# EAGLE board cw-lite-main (EAGLE 9.5.0), part 1 of 2
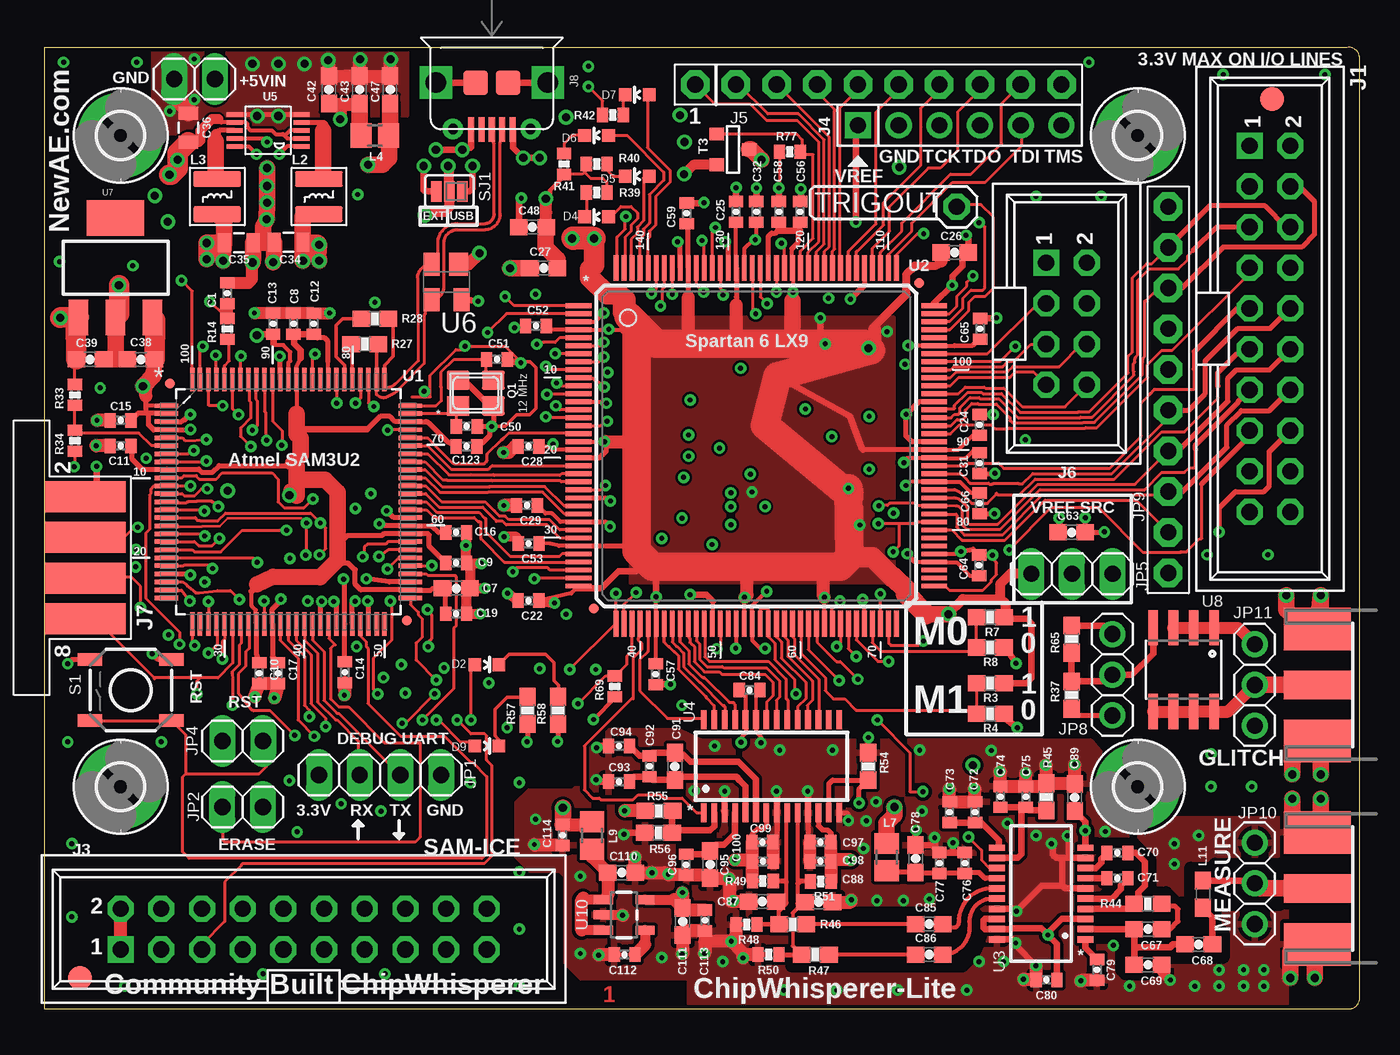
[diagram p8: board, top side]
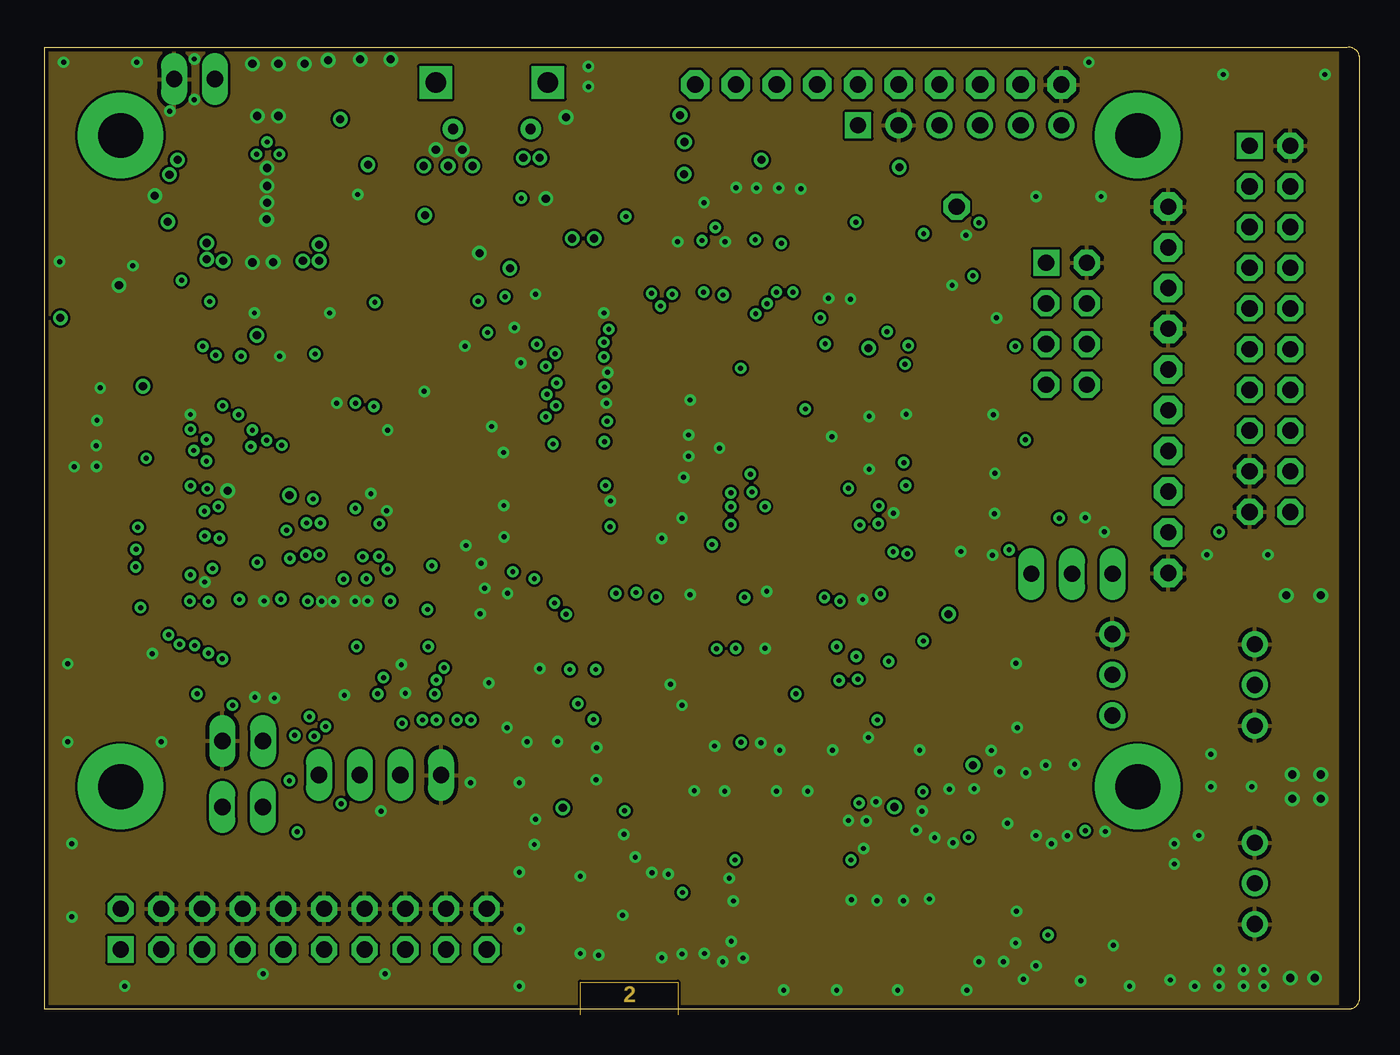
[diagram p9: board, inner layer GNDPour]
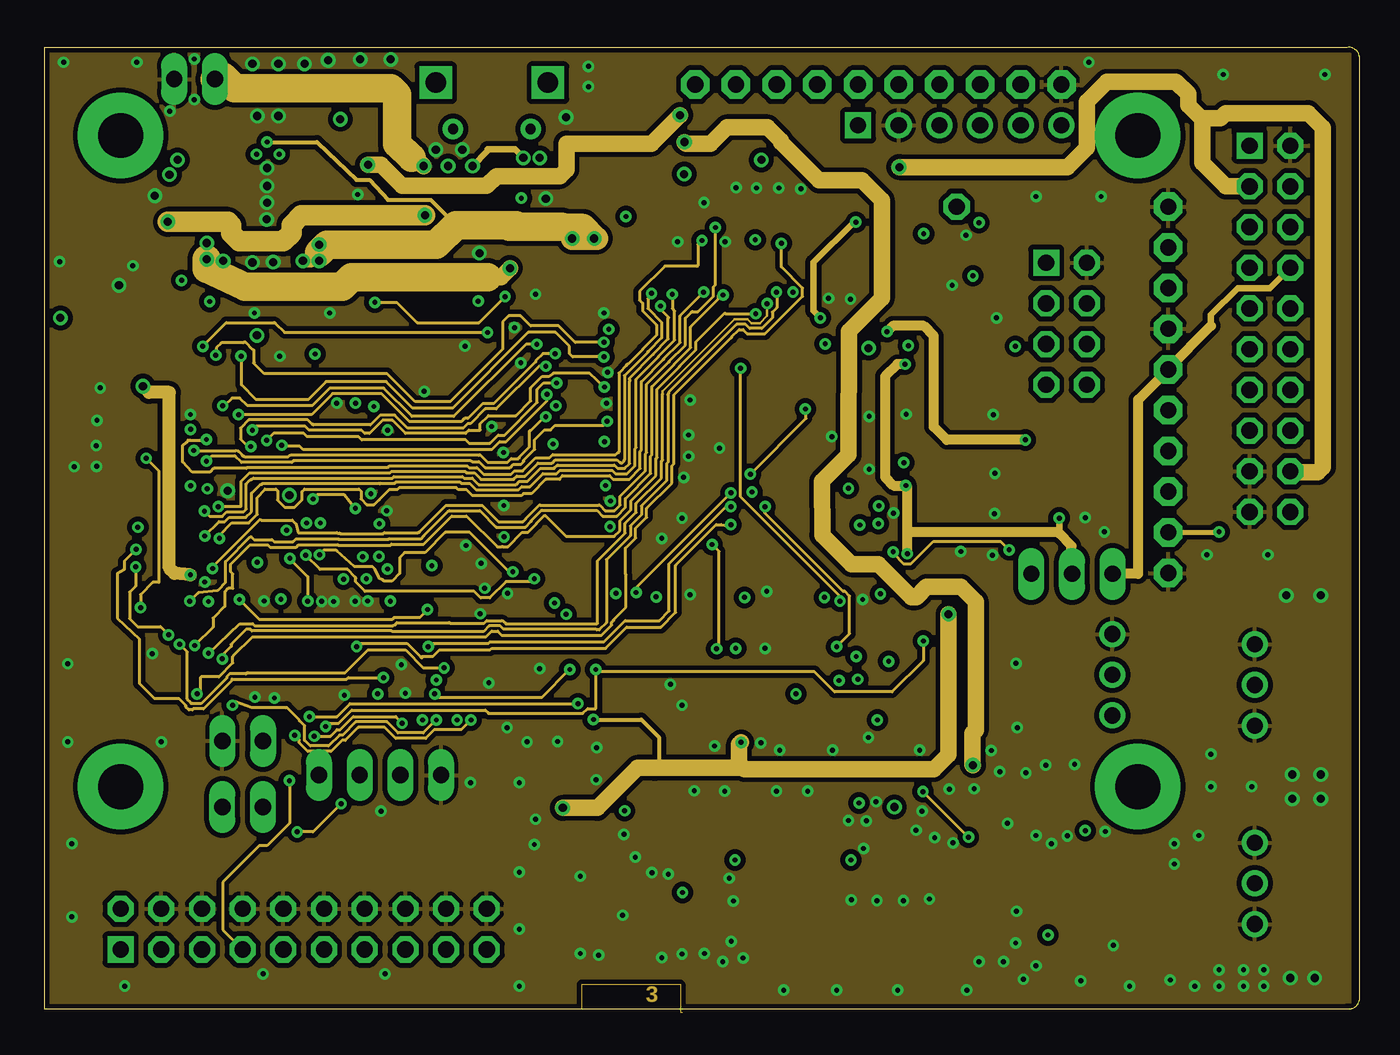
[diagram p10: board, inner layer Route15]
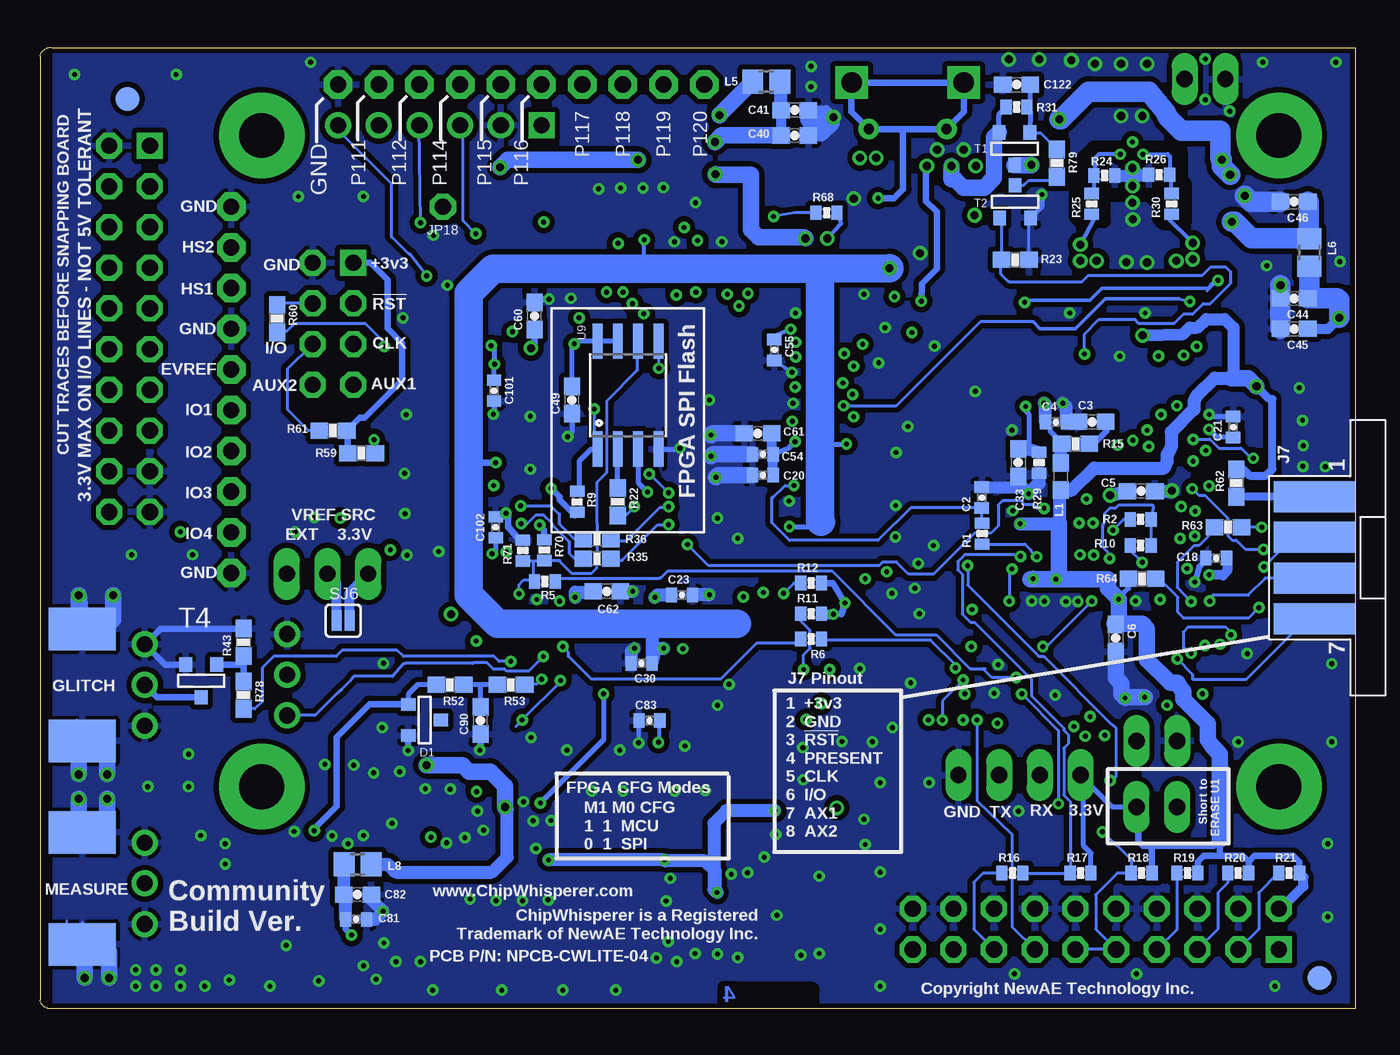
[diagram p11: board, bottom side, seen from below]

Size 82.12 x 60 mm. Coordinates in mm from the lower left corner, seen from the top.
Outline: 0,0 81.36,0.02 arc90 82.12,0.53 82.12,59.45 arc90 81.36,59.99 0,59.99 0,0
Copper layers (1*2*15*16): Top 0.035mm / dielectric 0.3mm / GNDPour 0.035mm / dielectric 0.86mm / Route15 0.035mm / dielectric 0.3mm / Bottom 0.035mm
Design rules "default *": minimum track width 6mil, minimum drill 12mil, track to track 6mil, track to pad 6mil, pad to pad 6mil, via to via 6mil, smd to smd 0mil, copper to edge 10mil, drill to drill 10mil, minimum pad ring 12mil, minimum via ring 8mil, stop-mask expansion 2mil, vias tented up to drill 25mil, thermal gap 10mil
Net classes: 0 default: width 0.152 mm; 1 USB Differential: width 0.191 mm, clearance 0.191 mm; 2 power: width 0.254 mm
tRestrict: 28 lines
bRestrict: 22 lines

## Footprints (pad centres in the part's own frame; a part is rotated, then mirrored left to right if it is on the bottom)
0402C = smd 0.7 x 0.9: 1 -0.65,0; 2 0.65,0
0603C = smd 1.1 x 1: 1 -0.85,0; 2 0.85,0
0805 = smd 0.8 x 1.2: 1 -0.9,0; 2 0.9,0
SOT-23 = smd 0.787 x 0.889: 1 0.025,-1.016; 2 -0.94,1.016; 3 0.991,1.016
LED-0603 = smd 0.8 x 0.8: A 0,-0.75; C 0,0.75
FIDUCIAL-1.5X3 = smd 1.5 x 1.5: 1 0,0
2,8-PAD = drill 2.8 pad 5.334: B2,8 0,0
PINSHRD_PTH_2X10 = drill 1.016 square: 1 -11.43,-1.27 | drill 1.016 octagon: 2 -11.43,1.27; 3 -8.89,-1.27; 4 -8.89,1.27; 5 -6.35,-1.27; 6 -6.35,1.27; 7 -3.81,-1.27; 8 -3.81,1.27; 9 -1.27,-1.27; 10 -1.27,1.27; 11 1.27,-1.27; 12 1.27,1.27; 13 3.81,-1.27; 14 3.81,1.27; 15 6.35,-1.27; 16 6.35,1.27; 17 8.89,-1.27; 18 8.89,1.27; 19 11.43,-1.27; 20 11.43,1.27
HEADER_PRG_1X06 = drill 1.016 square: 1 -6.35,0 | drill 1.016: 2 -3.81,0; 3 -1.27,0; 4 1.27,0; 5 3.81,0; 6 6.35,0
1X10-BIG = drill 1.016 pad 1.778 octagon: 1 -11.43,0; 2 -8.89,0; 3 -6.35,0; 4 -3.81,0; 5 -1.27,0; 6 1.27,0; 7 3.81,0; 8 6.35,0; 9 8.89,0; 10 11.43,0
PINSHRD_PTH_2X04 = drill 1.016 square: 1 -3.81,-1.27 | drill 1.016 octagon: 2 -3.81,1.27; 3 -1.27,-1.27; 4 -1.27,1.27; 5 1.27,-1.27; 6 1.27,1.27; 7 3.81,-1.27; 8 3.81,1.27
PINSHRD_EDGE_2X04.PAC = smd 1.93 x 5.08 bottom: 1 -3.81,0; 3 -1.27,0; 5 1.27,0; 7 3.81,0 | smd 1.93 x 5.08: 2 -3.81,0; 4 -1.27,0; 6 1.27,0; 8 3.81,0
B-SMD-5P-TH = smd 0.38 x 1.52: 1 -1.3,2.921; 2 -0.65,2.921; 3 0,2.921; 4 0.65,2.921; 5 1.3,2.921 | smd 1.524 x 1.524: E1 -1.016,0; E2 1.016,0 | drill 1.27 pad 2.032 square: P$1 -3.5,0; P$2 3.5,0 | drill 0.635 pad 1.27: P$3 -2.425,2.9; P$4 2.425,2.9
1X04 = drill 1.016 long: 1 -3.81,0; 2 -1.27,0; 3 1.27,0; 4 3.81,0
1X02 = drill 1.016 long: 1 -1.27,0; 2 1.27,0
1X03 = drill 1.016 long: 1 -2.54,0; 2 0,0; 3 2.54,0
1X03' = drill 1.016: 1 -2.54,0; 2 0,0; 3 2.54,0
1X01 = drill 1.016 octagon: 1 0,0
0603 = smd 1.1 x 1: 1 -0.85,0; 2 0.85,0
VLS3015 = smd 3 x 1: 1 0,1.1; 2 0,-1.1
FB603 = smd 1.3 x 1.5: 1 -0.85,0; 2 0.85,0
MICRO-FIDUCIAL = smd 0.635 x 0.635: 1 0,0
NX3225 = smd 1.4 x 1.2: 1 -1.1,-0.8; 2 1.1,-0.8; 3 1.1,0.8; 4 -1.1,0.8
0402R = smd 0.7 x 0.9: 1 -0.65,0; 2 0.65,0
0603R = smd 1.1 x 1: 1 -0.85,0; 2 0.85,0
TACTILE_SWITCH_SMD = smd 1.524 x 0.762: 1 -2.54,1.905; 2 2.54,1.905; 3 -2.54,-1.905; 4 2.54,-1.905
SJ_3_PASTE1&2 = smd 0.635 x 1.27: 1 -0.813,0; 2 0,0; 3 0.813,0
SJ_2S = smd 0.635 x 1.27: 1 -0.412,0; 2 0.412,0
QFP50P1600X1600X160-100N = smd 1.473 x 0.279: 1 -7.62,5.994; 2 -7.62,5.512; 3 -7.62,5.004; 4 -7.62,4.496; 5 -7.62,3.988; 6 -7.62,3.505; 7 -7.62,2.997; 8 -7.62,2.489; 9 -7.62,2.007; 10 -7.62,1.499; 11 -7.62,0.991; 12 -7.62,0.508; 13 -7.62,0; 14 -7.62,-0.508; 15 -7.62,-0.991; 16 -7.62,-1.499; 17 -7.62,-2.007; 18 -7.62,-2.489; 19 -7.62,-2.997; 20 -7.62,-3.505; 21 -7.62,-3.988; 22 -7.62,-4.496; 23 -7.62,-5.004; 24 -7.62,-5.512; 25 -7.62,-5.994; 51 7.62,-5.994; 52 7.62,-5.512; 53 7.62,-5.004; 54 7.62,-4.496; 55 7.62,-3.988; 56 7.62,-3.505; 57 7.62,-2.997; 58 7.62,-2.489; 59 7.62,-2.007; 60 7.62,-1.499; 61 7.62,-0.991; 62 7.62,-0.508; 63 7.62,0; 64 7.62,0.508; 65 7.62,0.991; 66 7.62,1.499; 67 7.62,2.007; 68 7.62,2.489; 69 7.62,2.997; 70 7.62,3.505; 71 7.62,3.988; 72 7.62,4.496; 73 7.62,5.004; 74 7.62,5.512; 75 7.62,5.994 | smd 0.279 x 1.473: 26 -5.994,-7.62; 27 -5.512,-7.62; 28 -5.004,-7.62; 29 -4.496,-7.62; 30 -3.988,-7.62; 31 -3.505,-7.62; 32 -2.997,-7.62; 33 -2.489,-7.62; 34 -2.007,-7.62; 35 -1.499,-7.62; 36 -0.991,-7.62; 37 -0.508,-7.62; 38 0,-7.62; 39 0.508,-7.62; 40 0.991,-7.62; 41 1.499,-7.62; 42 2.007,-7.62; 43 2.489,-7.62; 44 2.997,-7.62; 45 3.505,-7.62; 46 3.988,-7.62; 47 4.496,-7.62; 48 5.004,-7.62; 49 5.512,-7.62; 50 5.994,-7.62; 76 5.994,7.62; 77 5.512,7.62; 78 5.004,7.62; 79 4.496,7.62; 80 3.988,7.62; 81 3.505,7.62; 82 2.997,7.62; 83 2.489,7.62; 84 2.007,7.62; 85 1.499,7.62; 86 0.991,7.62; 87 0.508,7.62; 88 0,7.62; 89 -0.508,7.62; 90 -0.991,7.62; 91 -1.499,7.62; 92 -2.007,7.62; 93 -2.489,7.62; 94 -2.997,7.62; 95 -3.505,7.62; 96 -3.988,7.62; 97 -4.496,7.62; 98 -5.004,7.62; 99 -5.512,7.62; 100 -5.994,7.62
TQ144 = smd 1.6 x 0.3: P1 -11.1,8.75; P2 -11.1,8.25; P3 -11.1,7.75; P4 -11.1,7.25; P5 -11.1,6.75; P6 -11.1,6.25; P7 -11.1,5.75; P8 -11.1,5.25; P9 -11.1,4.75; P10 -11.1,4.25; P11 -11.1,3.75; P12 -11.1,3.25; P13 -11.1,2.75; P14 -11.1,2.25; P15 -11.1,1.75; P16 -11.1,1.25; P17 -11.1,0.75; P18 -11.1,0.25; P19 -11.1,-0.25; P20 -11.1,-0.75; P21 -11.1,-1.25; P22 -11.1,-1.75; P23 -11.1,-2.25; P24 -11.1,-2.75; P25 -11.1,-3.25; P26 -11.1,-3.75; P27 -11.1,-4.25; P28 -11.1,-4.75; P29 -11.1,-5.25; P30 -11.1,-5.75; P31 -11.1,-6.25; P32 -11.1,-6.75; P33 -11.1,-7.25; P34 -11.1,-7.75; P35 -11.1,-8.25; P36 -11.1,-8.75; P73 11.1,-8.75; P74 11.1,-8.25; P75 11.1,-7.75; P76 11.1,-7.25; P77 11.1,-6.75; P78 11.1,-6.25; P79 11.1,-5.75; P80 11.1,-5.25; P81 11.1,-4.75; P82 11.1,-4.25; P83 11.1,-3.75; P84 11.1,-3.25; P85 11.1,-2.75; P86 11.1,-2.25; P87 11.1,-1.75; P88 11.1,-1.25; P89 11.1,-0.75; P90 11.1,-0.25; P91 11.1,0.25; P92 11.1,0.75; P93 11.1,1.25; P94 11.1,1.75; P95 11.1,2.25; P96 11.1,2.75; P97 11.1,3.25; P98 11.1,3.75; P99 11.1,4.25; P100 11.1,4.75; P101 11.1,5.25; P102 11.1,5.75; P103 11.1,6.25; P104 11.1,6.75; P105 11.1,7.25; P106 11.1,7.75; P107 11.1,8.25; P108 11.1,8.75 | smd 0.3 x 1.6: P37 -8.75,-11.1; P38 -8.25,-11.1; P39 -7.75,-11.1; P40 -7.25,-11.1; P41 -6.75,-11.1; P42 -6.25,-11.1; P43 -5.75,-11.1; P44 -5.25,-11.1; P45 -4.75,-11.1; P46 -4.25,-11.1; P47 -3.75,-11.1; P48 -3.25,-11.1; P49 -2.75,-11.1; P50 -2.25,-11.1; P51 -1.75,-11.1; P52 -1.25,-11.1; P53 -0.75,-11.1; P54 -0.25,-11.1; P55 0.25,-11.1; P56 0.75,-11.1; P57 1.25,-11.1; P58 1.75,-11.1; P59 2.25,-11.1; P60 2.75,-11.1; P61 3.25,-11.1; P62 3.75,-11.1; P63 4.25,-11.1; P64 4.75,-11.1; P65 5.25,-11.1; P66 5.75,-11.1; P67 6.25,-11.1; P68 6.75,-11.1; P69 7.25,-11.1; P70 7.75,-11.1; P71 8.25,-11.1; P72 8.75,-11.1; P109 8.75,11.1; P110 8.25,11.1; P111 7.75,11.1; P112 7.25,11.1; P113 6.75,11.1; P114 6.25,11.1; P115 5.75,11.1; P116 5.25,11.1; P117 4.75,11.1; P118 4.25,11.1; P119 3.75,11.1; P120 3.25,11.1; P121 2.75,11.1; P122 2.25,11.1; P123 1.75,11.1; P124 1.25,11.1; P125 0.75,11.1; P126 0.25,11.1; P127 -0.25,11.1; P128 -0.75,11.1; P129 -1.25,11.1; P130 -1.75,11.1; P131 -2.25,11.1; P132 -2.75,11.1; P133 -3.25,11.1; P134 -3.75,11.1; P135 -4.25,11.1; P136 -4.75,11.1; P137 -5.25,11.1; P138 -5.75,11.1; P139 -6.25,11.1; P140 -6.75,11.1; P141 -7.25,11.1; P142 -7.75,11.1; P143 -8.25,11.1; P144 -8.75,11.1
QSOP20 = smd 0.4 x 1: 1 -2.858,-2.75; 2 -2.223,-2.75; 3 -1.588,-2.75; 4 -0.953,-2.75; 5 -0.318,-2.75; 6 0.318,-2.75; 7 0.953,-2.75; 8 1.588,-2.75; 9 2.223,-2.75; 10 2.858,-2.75; 11 2.858,2.75; 12 2.223,2.75; 13 1.588,2.75; 14 0.953,2.75; 15 0.318,2.75; 16 -0.318,2.75; 17 -0.953,2.75; 18 -1.588,2.75; 19 -2.223,2.75; 20 -2.858,2.75
TSSOP28 = smd 0.35 x 1.2: 1 -4.225,-2.9; 2 -3.575,-2.9; 3 -2.925,-2.9; 4 -2.275,-2.9; 5 -1.625,-2.9; 6 -0.975,-2.9; 7 -0.325,-2.9; 8 0.325,-2.9; 9 0.975,-2.9; 10 1.625,-2.9; 11 2.275,-2.9; 12 2.925,-2.9; 13 3.575,-2.9; 14 4.225,-2.9; 15 4.225,2.9; 16 3.575,2.9; 17 2.925,2.9; 18 2.275,2.9; 19 1.625,2.9; 20 0.975,2.9; 21 0.325,2.9; 22 -0.325,2.9; 23 -0.975,2.9; 24 -1.625,2.9; 25 -2.275,2.9; 26 -2.925,2.9; 27 -3.575,2.9; 28 -4.225,2.9
MSOP10 = smd 0.28 x 1: 1 -1,-2.1; 2 -0.5,-2.1; 3 0,-2.1; 4 0.5,-2.1; 5 1,-2.1; 6 1,2.1; 7 0.5,2.1; 8 0,2.1; 9 -0.5,2.1; 10 -1,2.1
SOT143B = smd 1.2 x 1.44: 1 -0.75,-1.1 | smd 1 x 1.44: 2 0.95,-1.1; 3 0.95,1.1; 4 -0.95,1.1
SOT223 = smd 1.219 x 2.235: 1 -2.311,-3.099; 2 0,-3.099; 3 2.311,-3.099 | smd 3.6 x 2.2: 4 0,3.099
SO08 = smd 0.61 x 2.21: 1 -1.905,-2.616; 2 -0.635,-2.616; 3 0.635,-2.616; 4 1.905,-2.616; 5 1.905,2.616; 6 0.635,2.616; 7 -0.635,2.616; 8 -1.905,2.616
SO08-EIAJ = smd 0.61 x 2.21: 1 -1.905,-3.378; 2 -0.635,-3.378; 3 0.635,-3.378; 4 1.905,-3.378; 5 1.905,3.353; 6 0.635,3.353; 7 -0.635,3.353; 8 -1.905,3.353
SOT23-5 = smd 0.55 x 1.2: 1 -0.95,-1.3; 2 0,-1.3; 3 0.95,-1.3; 4 0.95,1.3; 5 -0.95,1.3
J502-ND-142-0711-821/826-NOSILK = smd 4.191 x 1.778: 1 2.115,0 | smd 4.191 x 2.667: G@1 2.115,3.495; G@2 2.115,-3.495 | smd 4.191 x 2.667 bottom: G@3 2.115,3.495; G@4 2.115,-3.495

## Placement (x,y rotation side)
C1  DNM  [0402C]  11.45,44.66 90 top  (not fitted)
C2  DNM  [0402C]  23.33,31.91 90 bottom  (not fitted)
C3  4u7  [0603C]  16.44,36.63 0 bottom
C4  100n  [0402C]  18.7,36.62 0 bottom
C5  2u2  [0603C]  13.38,32.3 0 bottom
C6  4u7  [0603C]  14.97,23.14 270 bottom
C7  4u7  [0603C]  25.73,26.24 0 top
C8  100n  [0402C]  15.57,42.75 90 top
C9  100n  [0402C]  25.73,27.83 0 top
C10  100n  [0402C]  13.44,20.95 270 top
C11  100n  [0402C]  4.78,35.13 180 top
C12  100n  [0402C]  16.84,42.75 90 top
C13  100n  [0402C]  14.3,42.75 90 top
C14  100n  [0402C]  18.78,21 270 top
C15  100n  [0402C]  4.78,36.72 180 top
C16  100n  [0402C]  25.73,29.73 0 top
C17  100n  [0402C]  14.6,20.95 270 top
C18  100n  [0402C]  8.69,28.12 180 bottom
C19  100n  [0402C]  25.73,24.66 0 top
C20  100n  [0402C]  37,33.3 180 bottom
C21  100n  [0402C]  7.64,36.31 90 bottom
C22  100n  [0402C]  30.24,25.47 180 top
C23  100n  [0402C]  42.04,25.82 0 bottom
C24  100n  [0402C]  58.41,36.43 90 top
C25  100n  [0402C]  43.2,49.74 90 top
C26  2u2  [0603C]  56.85,47.2 0 top
C27  2u2  [0603C]  31.2,46.22 0 top
C28  100n  [0402C]  30.24,35.1 180 top
C29  100n  [0402C]  30.15,31.42 180 top
C30  100n  [0402C]  44.57,21.56 180 bottom
C31  100n  [0402C]  58.41,34.05 270 top
C32  100n  [0402C]  44.47,49.74 90 top
C33  10pF  [0603C]  21.05,34.08 270 bottom
C34  22u  [0805]  15.26,47.83 180 top
C35  22u  [0805]  12.16,47.81 0 top
C36  22u  [0805]  9.01,54.98 90 top
C38  2u2  [0603C]  6.05,40.53 180 top
C39  2u2  [0603C]  2.88,40.53 0 top
C40  2u2  [0603C]  35.01,54.5 0 bottom
C41  100n  [0603C]  35.01,56.09 0 bottom
C42  10u  [0603C]  17.8,57.36 90 top
C43  100n  [0603C]  19.7,57.36 90 top
C44  100n  [0603C]  3.83,44.34 180 bottom
C45  1u  [0603C]  3.83,42.44 180 bottom
C46  10n  [0603C]  3.83,50.37 180 bottom
C47  10n  [0603C]  21.61,57.36 90 top
C48  100n  [0603C]  30.5,48.78 0 top
C49  100n  [0603C]  48.91,37.99 90 bottom
C50  18pF  [0402C]  26.4,36.35 180 top
C51  18pF  [0402C]  28.27,40.53 180 top
C52  100n  [0402C]  30.71,42.61 180 top
C53  100n  [0402C]  30.26,29.04 180 top
C54  100n  [0402C]  37,34.6 180 bottom
C55  100n  [0402C]  36.28,41.11 270 bottom
C56  100n  [0402C]  47.2,49.74 90 top
C57  100n  [0402C]  38.18,20.88 270 top
C58  100n  [0402C]  45.88,49.74 90 top
C59  100n  [0402C]  40.12,49.64 90 top
C60  1u  [0603C]  51.25,43.24 90 bottom
C61  1u  [0603C]  37.3,35.91 180 bottom
C62  1u  [0603C]  46.74,26.05 0 bottom
C63  1u  [0603C]  64.15,29.73 0 top
C64  100n  [0402C]  58.37,27.67 90 top
C65  100n  [0402C]  58.44,42.44 90 top
C66  100n  [0402C]  58.41,31.54 270 top
C67  18nF  [0603C]  68.92,4.97 180 top
C68  100n  [0603C]  72.09,4.02 180 top
C69  22pF  [0603C]  68.92,2.75 180 top
C70  100n  [0402C]  67.01,9.73 0 top
C71  100n  [0402C]  67.01,8.14 0 top
C72  1nF  [0402C]  58.12,12.27 270 top
C73  100n  [0402C]  56.53,12.27 270 top
C74  1nF  [0402C]  59.71,13.23 270 top
C75  100n  [0402C]  61.3,13.23 270 top
C76  1nF  [0402C]  57.48,9.1 270 top
C77  100n  [0402C]  55.9,9.1 270 top
C78  1u  [0603C]  54.41,9.36 270 top
C79  100n  [0402C]  65.74,2.43 90 top
C80  100n  [0402C]  62.59,1.81 0 top
C81  100n  [0402C]  62.39,5.58 180 bottom
C82  1u  [0603C]  62.3,7.13 180 bottom
C83  100n  [0402C]  44.09,17.99 0 bottom
C84  10n  [0402C]  44.05,19.89 180 top
C85  100n  [0603C]  55.26,5.29 0 top
C86  100n  [0603C]  55.26,3.38 0 top
C87  100pF  [0603C]  44.85,6.68 0 top
C88  100pF  [0603C]  48.37,6.65 0 top
C89  1u  [0603C]  64.34,13.19 270 top
C90  1u  [0603C]  54.63,17.99 90 bottom
C91  10u  [0603C]  39.39,15.13 270 top
C92  100n  [0402C]  37.8,15.13 270 top
C93  100n  [0402C]  35.9,14.18 180 top
C94  100n  [0402C]  35.9,16.4 180 top
C95  10u  [0603C]  41.58,9 90 top
C96  100n  [0402C]  40.09,9 90 top
C97  10n  [0402C]  48.47,10.4 180 top
C98  100n  [0402C]  48.47,9.19 180 top
C99  10n  [0402C]  44.85,10.4 0 top
C100  100n  [0402C]  44.88,9.19 0 top
C101  220n  [0402C]  53.78,38.57 270 bottom
C102  220n  [0402C]  53.67,30.05 90 bottom
C110  1u  [0603C]  36.05,8.49 180 top
C111  1u  [0603C]  39.86,5.45 90 top
C112  10n, COG  [0402C]  36.24,3.38 0 top
C113  100n  [0402C]  41.26,5.51 90 top
C114  100n  [0402C]  32.37,10.84 90 top
C122  DNM  [0603C]  21.16,57.67 180 bottom  (not fitted)
C123  100n  [0402C]  26.37,35.09 0 top
D1  [SOT-23]  58.12,17.99 90 bottom
D2  [LED-0603]  27.64,21.48 270 top
D4  [LED-0603]  34.5,49.42 90 top
D5  [LED-0603]  37.04,51.96 90 top
D6  [LED-0603]  34.5,54.5 90 top
D7  [LED-0603]  37.04,57.04 90 top
D9  [LED-0603]  27.64,16.4 270 top
FID1  FIDUCIAL1.5X3  [FIDUCIAL-1.5X3]  2.24,1.92 0 top
FID2  FIDUCIAL1.5X3  [FIDUCIAL-1.5X3]  76.66,56.79 0 top
FID3  FIDUCIAL1.5X3  [FIDUCIAL-1.5X3]  89.87,1.92 0 top  (outside the outline)
FID4  FIDUCIAL1.5X3  [FIDUCIAL-1.5X3]  89.87,1.92 0 bottom  (outside the outline)
FID5  FIDUCIAL1.5X3  [FIDUCIAL-1.5X3]  76.66,56.79 0 bottom
FID6  FIDUCIAL1.5X3  [FIDUCIAL-1.5X3]  2.24,1.92 0 bottom
H1  MOUNT-PAD-ROUND2.8  [2,8-PAD]  4.78,54.5 0 top
H2  MOUNT-PAD-ROUND2.8  [2,8-PAD]  68.28,54.5 0 top
H3  MOUNT-PAD-ROUND2.8  [2,8-PAD]  68.28,13.86 0 top
H4  MOUNT-PAD-ROUND2.8  [2,8-PAD]  4.78,13.86 0 top
J1  SHROUD_2X10-SHROUDED  [PINSHRD_PTH_2X10]  76.53,42.44 270 top  (not fitted)
J3  SHROUD_2X10-SHROUDED  [PINSHRD_PTH_2X10]  16.21,4.97 0 top  (not fitted)
J4  CON_HEADER_PRG_XILINX_JTAG6  [HEADER_PRG_1X06]  57.17,55.14 0 top  (not fitted)
J5  PINHD-1X10  [1X10-BIG]  52.09,57.67 0 top  (not fitted)
J6  SHROUD_2X4SHROUD  [PINSHRD_PTH_2X04]  63.83,42.75 270 top  (not fitted)
J7  SHROUD_2X4EDGE  [PINSHRD_EDGE_2X04.PAC]  2.56,28.15 270 top  (not fitted)
J8  MICRO-USB-5P-ZX62D-B-5P8  [B-SMD-5P-TH]  27.96,57.8 180 top
JP1  [1X04]  20.97,14.58 180 top  (not fitted)
JP2  [1X02]  12.4,16.72 180 top  (not fitted)
JP3  [1X02]  9.39,58.02 180 top  (not fitted)
JP4  [1X02]  12.4,12.59 0 top  (not fitted)
JP5  [1X03]  64.18,27.14 0 top  (not fitted)
JP8  [1X03']  66.69,20.84 90 top  (not fitted)
JP9  PINHD-1X10  [1X10-BIG]  70.19,38.62 270 top  (not fitted)
JP10  [1X03']  75.58,7.83 90 top  (not fitted)
JP11  [1X03']  75.58,20.21 90 top  (not fitted)
JP18  [1X01]  56.98,50.05 0 top
L1  10uH/100mA  [0603]  18.39,33.21 90 bottom
L2  3.3uH  [VLS3015]  17.16,50.69 0 top
L3  3.3uH  [VLS3015]  10.81,50.69 0 top
L4  600R/1A  [FB603]  20.66,54.5 180 top
L5  1k/500mA  [FB603]  36.78,57.87 0 bottom
L6  600R/1A  [FB603]  2.88,47.2 270 bottom
L7  1k/500mA  [FB603]  52.61,9.47 270 top
L8  1k/500mA  [FB603]  62.3,9.01 180 bottom
L9  1k/500mA  [FB603]  34.21,10.81 270 top
L11  120nH  [0603]  72.34,7.15 270 top
MFID1  FIDUCIALUFIDUCIAL  [MICRO-FIDUCIAL]  22.66,24.24 0 top
MFID2  FIDUCIALUFIDUCIAL  [MICRO-FIDUCIAL]  7.86,39.04 0 top
MFID3  FIDUCIALUFIDUCIAL  [MICRO-FIDUCIAL]  54.63,45.29 0 top
MFID4  FIDUCIALUFIDUCIAL  [MICRO-FIDUCIAL]  34.31,24.97 0 top
Q1  [NX3225]  26.95,38.43 0 top
R1  1R  [0402R]  23.31,29.65 90 bottom
R2  330R  [0402R]  13.4,30.55 0 bottom
R3  1k  [0603R]  59.07,20.31 180 top
R4  DNM  [0603R]  59.07,18.42 180 top  (not fitted)
R5  1R  [0402R]  50.6,26.67 0 bottom
R6  1R  [0402R]  33.99,23.07 180 bottom
R7  1k  [0603R]  59.07,24.44 180 top
R8  DNM  [0603R]  59.07,22.55 180 top  (not fitted)
R9  10k  [0402R]  48.59,31.64 270 bottom
R10  330R  [0402R]  13.4,28.92 0 bottom
R11  10k  [0402R]  33.99,24.66 0 bottom
R12  10k  [0402R]  33.99,26.56 0 bottom
R14  1R  [0402R]  11.45,42.44 90 top
R15  1R  [0603R]  17.48,35.26 180 bottom
R16  1k  [0402R]  21.42,8.46 0 bottom
R17  100k  [0402R]  17.16,8.46 0 bottom
R18  100k  [0402R]  13.35,8.46 0 bottom
R19  100k  [0402R]  10.5,8.46 0 bottom
R20  100k  [0402R]  7.32,8.46 0 bottom
R21  100k  [0402R]  4.14,8.46 0 bottom
R22  DNM  [0603R]  46.05,31.64 270 bottom  (not fitted)
R23  2k  [0603R]  21.24,46.74 0 bottom
R24  1k5  [0402R]  15.68,52 180 bottom
R25  6k81  [0402R]  16.46,50.23 90 bottom
R26  1k5  [0402R]  12.26,52.05 0 bottom
R27  39R  [0603R]  20.02,41.48 0 top
R28  39R  [0603R]  20.66,43.07 0 top
R29  6k81  [0402R]  19.75,34.08 90 bottom
R30  1k5  [0402R]  11.49,50.23 90 bottom
R31  100k  [0402R]  21.16,56.28 180 bottom
R33  47k  [0402R]  1.92,38.31 90 top
R34  68k  [0402R]  1.92,35.45 90 top
R35  39R  [0603R]  47.35,28.08 0 bottom
R36  39R  [0603R]  47.35,29.3 0 bottom
R37  1R  [0603R]  64.15,19.57 270 top
R39  330R  [0402R]  34.5,50.94 0 top
R40  330R  [0402R]  34.5,52.72 180 top
R41  330R  [0402R]  32.47,52.72 270 top
R42  330R  [0402R]  35.51,55.77 180 top
R43  10k  [0603R]  69.42,22.88 90 bottom
R44  274R  [0603R]  68.92,6.56 180 top
R45  10k  [0603R]  62.56,13.23 270 top
R46  33R,0.5%  [0603R]  46.74,5.27 180 top
R47  33R,0.5%  [0603R]  48.15,3.38 180 top
R48  1k  [0402R]  43.86,5.26 180 top
R49  1k  [0402R]  44.88,7.99 180 top
R50  1k  [0402R]  45.23,3.38 0 top
R51  1k  [0402R]  48.5,7.95 180 top
R52  2k  [0603R]  56.53,20.21 180 bottom
R53  2k  [0603R]  52.72,20.21 180 bottom
R54  100R  [0603R]  51.45,15.13 270 top
R55  2k  [0603R]  38.38,12.35 180 top
R56  1k  [0603R]  38.36,10.98 0 top
R57  1k  [0603R]  30.18,18.62 90 top
R58  1k  [0603R]  32.09,18.62 90 top
R59  1R  [0603R]  62.06,34.68 180 bottom
R60  DNM  [0603R]  67.33,43.07 270 bottom  (not fitted)
R61  10k  [0603R]  63.83,36.09 180 bottom
R62  1R  [0603R]  7.43,32.81 270 bottom
R63  1k  [0603R]  7.95,30.05 0 bottom
R64  10k  [0603R]  13.32,26.85 180 bottom
R65  10k  [0603R]  64.15,23.07 90 top
R68  1k  [0402R]  33.02,49.68 0 bottom
R69  10k  [0402R]  35.64,20.11 90 top
R70  DNM  [0402R]  50.65,28.62 270 bottom  (not fitted)
R71  DNM  [0402R]  51.97,28.6 90 bottom  (not fitted)
R77  10k  [0402R]  46.56,53.48 0 top
R78  1R  [0603R]  69.42,19.57 270 bottom
R79  1k  [0603R]  18.64,52.78 90 bottom
S1  [TACTILE_SWITCH_SMD]  5.41,19.89 180 top  (not fitted)
SJ1  [SJ_3_PASTE1&2]  25.3,51.01 180 top
SJ6  SOLDERJUMPERNC  [SJ_2S]  63.2,24.22 180 bottom
T1  IRLML6402TRPBF  [SOT-23]  21.32,53.67 0 bottom
T2  IRLML2502  [SOT-23]  21.21,50.37 180 bottom
T3  IRLML6402TRPBF  [SOT-23]  43.01,53.61 90 top
T4  IRLML2502  [SOT-23]  72.09,20.46 0 bottom
U1  ATSAM3U2CA-AU  [QFP50P1600X1600X160-100N]  15.26,31.64 0 top
U2  6SLX9TQG144  [TQ144]  44.47,35.13 0 top
U3  AD8331  [QSOP20]  62.25,7.19 90 top
U4  AD9215BRUZ  [TSSOP28]  45.42,15.13 0 top
U5  LTC3419EMS  [MSOP10]  13.99,54.82 90 top
U6  PRTR5V0U2AX  [SOT143B]  25.13,45.36 180 top
U7  TC1262-3.3VDBTR  [SOT223]  4.46,46.24 0 top
U8  IRF7807ZTRPBF  [SO08]  71.14,21.16 180 top
U9  SPI_FLASH-X25XXSMD1  [SO08-EIAJ]  45.42,38.31 0 bottom  (not fitted)
U10  LP3985IM5-3.0  [SOT23-5]  36.21,5.86 270 top
X2  SMA-NOSILK  [J502-ND-142-0711-821/826-NOSILK]  81.61,7.51 180 top  (not fitted)
X4  SMA-NOSILK  [J502-ND-142-0711-821/826-NOSILK]  81.61,20.21 180 top  (not fitted)

## Tracks (layer width: path | path; a pad name or v marks a point on that pad's centre or on a via)
!TIOVCC_ON
  Top 0.178: U2.P121 47.22,47.28 48.01,48.07 48.01,53.31 47.39,53.31 R77.2 47.33,53.6 47.33,54.25 46.97,54.6 T3.3
!USBALE
  Top 0.178: U2.P30 33.35,29.38 32.21,29.38 31.4,30.19 28.86,30.19 28.63,30.42 28.25,30.42 28.2,30.47 28.2,30.5 27.39,31.31 24.67,31.31 23.83,32.15 U1.64
!USBCE
  Top 0.178: U2.P29 33.35,29.89 32.19,29.89 31.55,30.52 29.01,30.52 28.78,30.75 28.43,30.75 28.15,31.03 28.15,31.06 28.1,31.11 28.07,31.11 27.54,31.64 24.82,31.64 23.83,32.63 U1.65
!USBRD
  Top 0.178: U1.66 23.8,33.14 24.72,32.22 27.69,32.22 arc45 27.73,32.24 31.13,32.24 32.5,30.88 33.35,30.88 U2.P27
!USBWR
  Top 0.178: U1.62 23.88,31.13 24.34,30.67 24.41,30.65 26.85,30.65 27.11,30.4 27.18,30.4 27.26,30.37 27.26,29.3 27.34,29.28 28.73,27.88 33.35,27.88 U2.P33
+3V3  (via drill 0.3, 0.51)
  Top 0.191: 18.78,24 U1.45
  Top 0.254: U1.60 | 24.62,29.73 C16.1 | U1.88 15.27,40.33 15.37,40.43 15.37,40.99 14.94,41.42 14.41,41.42 14.33,41.49 | U1.1 6.46,37.63 6.36,37.53
  Top 0.305: C14.1 18.78,24 | C17.1 14.27,21.96 U1.36 14.25,24.03 14.25,24.93 14.79,25.47 v14.79,25.57 14.79,25.62 | U1.60 24.21,30.15 24.62,29.73 | U1.2 6.53,37.15 | 6.53,37.15 6.43,37.15 | 6.43,37.15 5.86,37.15 C15.1 | 6.36,38.24 6.36,37.53 6.36,37.23 6.43,37.15 | 6.53,37.15 6.53,36.44 6.84,36.14 U1.4 9.12,36.14 v9.15,36.16 | U1.53 21.57,26.64 v20.12,26.84 | U1.60 21.06,30.14 v20.93,30.27 | U1.45 18.76,26.75 v18.7,26.81 | U1.22 9.1,27.14 v9.14,27.08
  Top 0.406: 14.33,41.49 14.33,42.08 C13.1 13.24,42.1 v13.29,42.03
  Top 0.508: 6.85,39.77 6.95,39.87
  Top 0.813: C38.1 6.95,39.87 | J3.1 J3.2 | 6.36,38.24 6.36,38.68 v6.18,38.85
  Top 1.016: 6.85,39.77 6.85,39.52 v6.18,38.85
  Top 1.27: C38.1 6.95,42.97 U7.3
  Route15 0.813: v9.14,27.08 8.15,27.18 7.83,27.5 7.83,38.47 6.56,38.47 v6.18,38.85
  Bottom 0.254: 7.56,35.58 C21.1
  Bottom 0.305: C21.1 8.64,35.66 v9.15,36.16 | R64.2 14.17,26.24 14.79,25.62 v14.79,25.57 | R17.2 16.51,9.72 16.97,10.18 16.97,14.39 JP1.4 15.17,12.59 JP4.2
  Bottom 0.406: R20.2 6.67,9.18 | 6.67,9.18 6.3,9.54 3.89,9.54 3.51,9.16 3.51,8.48 R21.2 | R19.2 9.84,9.18 9.48,9.54 8.34,9.54 | 8.34,9.54 7.04,9.54 6.67,9.18 | JP4.2 13.54,12.46 13.54,10.43 13.29,10.18 12.91,10.18 | 12.91,10.18 8.84,10.18 8.46,10.56 8.46,9.67 8.34,9.54 | R18.2 12.7,9.97 12.91,10.18
  Bottom 0.508: R62.1 7,33.66 6.61,33.27 5.59,33.27 5.19,33.67 5.19,38.04 5.36,38.04 v6.18,38.85
  Bottom 0.61: J3.2 4.65,6.24 3.26,7.64 3.26,8.22 R21.2 | C18.1 8.01,27.32 8.27,27.05 v9.14,27.08
  Bottom 0.762: v13.29,42.03 10.77,42.1 10.37,42.51 9.86,42.51 9.33,43.05 8.16,43.05 7.62,42.51 7.62,39.49 7.75,39.36
  Bottom 0.813: v20.93,30.27 18.57,30.27 18.52,30.32 18.45,30.4 18.45,32.31 L1.1 17.7,32.37 16.31,33.75 11.94,33.75 11.77,34.13 11.77,34.59 11.69,34.66 11.51,35.04 11.51,35.98 10.09,37.41 10.09,37.86 9.91,38.24 8.79,39.36 7.75,39.36
  Bottom 1.016: v20.12,26.84 20.3,26.81 v18.7,26.81 | v18.7,26.81 15.45,26.81 15.45,26.23 v14.79,25.57 14.79,24.17 C6.1 | 18.52,30.32 18.52,26.99 v18.7,26.81 | 14.81,24.15 14.94,24.15 15.07,24.02 C6.1 | 8.46,10.56 8.46,15.89 8.97,16.4 9.23,16.78 9.23,17.8 10.75,19.32 10.75,19.83 10.88,19.96 11.13,20.34 11.56,20.34 13.01,21.79 13.01,23.72 13.31,24.02 14.94,24.02 C6.1 | 7.75,39.36 6.68,39.36 v6.18,38.85
+5VCLEAN  (via drill 0.51)
  Top 1.016: v53.09,12.59 53.09,12.08 52.58,11.57 52.58,10.34 L7.1
  Route15 1.016: v57.99,15.21 57.97,15.23 57.97,17.19 58.17,17.39 58.17,25.42 57.26,26.33 55.1,26.33 54.46,25.7 54.16,25.7 52.1,27.75 50.4,27.75 48.59,29.56 48.57,32.91 50.22,34.56 50.25,42.28 52.3,44.34 52.3,50.46 51.06,51.71 48.39,51.71 46,54.09 46,54.17 45.17,55.01 42.63,55.01 41.61,53.99 40.09,53.99 v39.98,54.09
  Bottom 0.61: C41.1 C40.1
  Bottom 0.813: L8.1 60.41,9.01 59.92,8.53 53.9,8.53 52.96,9.47 52.96,12.46 v53.09,12.59 | C41.1 35.86,57.79 L5.2
  Bottom 1.016: C40.1 39.58,54.5 v39.98,54.09 | v57.99,15.21 55.73,15.21 55.33,14.8 54,14.8 53.09,13.89 v53.09,12.59
ADC_CLK  (via drill 0.3)
  Top 0.178: v46.94,19.65 46.84,19.75 46.84,20.57 45.62,21.79 45.62,22.8 45.22,23.21 U2.P56 45.22,24.91 45.14,24.98 44.76,24.98 44.72,24.94 U2.P55
  Top 0.305: U4.13 48.99,14.03 49.23,14.27 51.44,14.27 R54.2 50.88,13.71 v50.88,12.84
  Bottom 0.305: v46.94,19.65 46.94,16.78 v50.88,12.84
ADC_D0
  Top 0.178: U4.17 48.37,18.13 48.37,20.57 46.84,22.09 46.84,23.11 46.74,23.21 46.74,24.02 U2.P59
ADC_D1
  Top 0.178: U4.18 47.66,18.13 47.66,18.94 47.96,19.25 47.96,20.46 46.44,21.99 46.44,23 46.23,23.21 46.23,24.02 U2.P58
ADC_D2
  Top 0.178: U4.19 47.05,18.13 47.05,18.84 47.55,19.35 47.55,20.36 46.03,21.89 46.03,22.9 45.73,23.21 U2.P57
ADC_D3
  Top 0.178: U2.P48 41.25,24.02 41.25,21.96 41.53,21.68 45.22,21.68 46.33,20.57 46.33,19.35 46.44,19.25 46.44,18.13 U4.20
ADC_D4
  Top 0.178: U2.P47 40.75,24.02 40.75,23 40.77,22.93 40.92,22.77 40.92,21.81 41.38,21.35 42.35,21.35 42.4,21.3 42.47,21.28 45.12,21.28 45.93,20.46 45.93,19.45 45.73,19.25 45.73,18.13 U4.21
ADC_D5
  Top 0.178: U2.P46 40.24,24.02 40.24,23.21 40.34,23.11 40.34,22.9 40.37,22.83 40.59,22.6 40.59,21.66 41.23,21.02 42.17,21.02 42.3,20.9 42.37,20.87 45.01,20.87 45.52,20.36 45.52,19.55 45.12,19.14 45.12,18.13 U4.22
ADC_D6
  Top 0.178: 39.7,22.97 39.73,22.88 40.26,22.34 40.26,21.5 41.08,20.69 41.15,20.67 41.23,20.67 42.78,19.12 43.06,19.12 43.08,19.04 43.13,18.99 43.13,18.15 U4.25
  Top 0.203: 39.7,22.97 39.7,24.02 U2.P45 | 43.13,18.05 U4.25
ADC_D7
  Top 0.178: U2.P44 39.22,22.88 39.48,22.62 39.5,22.62 39.93,22.19 39.93,21.35 40.92,20.36 40.95,20.36 42.4,18.91 42.47,18.91 42.5,18.84 42.5,18.05 U4.26
ADC_D8
  Top 0.178: 38.72,22.94 38.74,22.85 38.99,22.6 39.02,22.6 39.32,22.29 39.35,22.29 39.6,22.04 39.6,21.2 41.33,19.47 41.36,19.4 41.84,18.91 41.84,18.15 U4.27
  Top 0.203: 41.83,18.05 U4.27 | 38.72,22.94 U2.P43
ADC_D9
  Top 0.178: U2.P41 37.7,24.02 37.7,22.29 37.19,21.79 37.19,19.85 38.92,18.13 41.15,18.13 U4.28
ADC_OR
  Top 0.178: 36.78,19.45 36.78,21.89 37.29,22.39 37.29,22.8 37.09,23 37.09,23.11 37.19,23.21 37.19,24.02 U2.P40 | 36.78,19.45 36.78,19.35 | 36.78,19.45 33.74,16.4 33.74,13.66 34.24,13.15 34.65,13.15 34.75,13.05 36.78,13.05 37.09,13.35 38.51,13.35 38.71,13.15 39.83,13.15 40.75,12.23 41.15,12.23 U4.1
ADC_VCC  (via drill 0.3)
  Top 0.305: U4.7 45.09,11.43 44.89,11.22 44.53,11.22 44.23,10.91 44.23,10.43 C99.1 | U4.12 48.34,11.42 48.59,11.17 48.92,11.17 49.13,10.96 C97.1
  Top 0.61: U10.5 39.35,6.81
  Top 0.813: C113.2 40,6.16 C111.2 | 39.35,6.81 C111.2 | R49.2 C100.1 | C100.1 44.23,10.37 C99.1 | R51.1 49.15,9.16 C98.1 | C98.1 C97.1 | R55.2 36.26,12.35 v36.25,12.36 | v39.86,7.26 C111.2 | v43.13,9.29 44.13,9.29 C100.1 | v50.37,9.29 49.21,9.29 C98.1
  Bottom 0.254: 43.24,9.29 v43.13,9.29
  Bottom 0.813: v36.25,12.36 39.27,12.36 40.06,11.57 40.06,7.46 39.96,7.36 | 39.96,7.36 v39.86,7.26 | 39.96,7.36 39.96,8.6 40.59,9.24 43.08,9.24 v43.13,9.29 | 43.24,9.29 v50.37,9.29
ANIN
  Top 0.152: X2.1 79.5,7.28 | X2.1 79.5,6.9 | 79.5,8.17 79.51,8.12 X2.1
  Top 0.406: JP10.2 75.41,8 L11.1
  Top 1.016: X2.1 75.9,7.51 JP10.2
CLK2  (via drill 0.3)
  Top 0.178: U2.P131 42.22,44.98 v42.4,44.54 | U1.24 8.59,26.13 v9.1,25.44
  Route15 0.178: v42.4,44.54 42.12,44.52 42.12,44.31 40.37,42.56 40.37,41.27 39.35,40.25 39.35,40.23 37.95,38.83 37.95,34.56 37.88,34.48 37.88,33.42 36.3,31.84 36.3,31.28 35.77,30.75 34.88,30.75 34.52,31.11 31.12,31.11 31.04,31.08 30.41,30.45 30.41,30.42 30.05,30.06 28.22,30.06 27.21,31.08 25.3,31.08 25.28,31.06 25.2,31.03 23.7,29.53 23.7,29.51 23.52,29.33 21.59,29.33 21.52,29.3 18.39,29.3 18.32,29.33 15.73,29.33 15.55,29.15 14.36,29.15 14.23,29.28 13.11,29.28 12.96,29.43 12.88,29.46 11.33,27.91 11.33,26.61 10.82,26.1 9.63,25.95 v9.1,25.44 9.3,25.52
  Bottom 0.178: J7.5 5.63,26.88 6.71,25.8 8.92,25.8 v9.1,25.44
D_N
  Top 0.191: 20.78,39.25 U1.77 20.77,38.3 20.81,38.3 arc64 21.37,38.16 arc31 22.19,38.72 23.74,40.27 23.74,43.3 23.78,43.34 23.78,43.53 24.18,43.93 U6.3 arc90 24.97,45.05 24.97,47.8 arc-90 25.8,48.63 27.55,48.63 arc90 28.48,49.64 28.48,54.02 J8.2
  Top 0.203: U1.77 20.77,41.38 R27.2
D_P
  Top 0.191: J8.3 28.08,53.87 28.1,54 28.1,49.64 arc-90 27.55,49.01 25.8,49.01 arc90 24.59,47.8 24.59,46.87 arc-90 U6.2 arc90 23.32,45.6 23.32,43.34 23.36,43.3 23.36,40.43 21.92,38.99 arc-49 21.29,38.75
  Top 0.203: 21.29,38.75 21.25,38.79 U1.76 21.25,40.17 21.8,40.72 21.8,42.78 R28.2
ERASE
  Top 0.178: 18.14,22.75 17.79,23.11 17.79,24.02 U1.43 | 18.14,22.75 18.19,22.7 | 18.14,22.75 17.89,22.5 17.89,19.35 18.39,18.84 19,18.84 21.24,16.6 23.47,16.6 23.47,10.71 23.17,10.41 11.28,10.41 11.18,10.51 11.18,12.54 JP4.1
FB_1V2  (via drill 0.3)
  Top 0.254: U5.10 12.78,53.82 v13.26,53.33
  Bottom 0.254: v13.26,53.33 11.74,53.33 11.59,53.18 11.59,52.07 R26.2 11.49,51.92 R30.2
FB_3V3  (via drill 0.3)
  Top 0.254: U5.1 15.17,53.82 v14.69,53.33
  Bottom 0.254: v14.69,53.33 16.01,53.33 16.26,53.08 16.26,52.06 R24.2 16.33,51.02 R25.2
FPGA_DONE  (via drill 0.3)
  Top 0.178: U2.P71 52.72,22.82 52.86,22.67 54.61,22.67 v54.89,22.95 | 17.58,17.42 v17.58,17.62 17.58,18.13 16.67,19.04 16.67,22.09 15.75,23 15.75,24.02 U1.39
  Route15 0.178: v17.58,17.62 17.79,17.82 18.39,17.82 19.21,18.64 27.54,18.64 27.74,18.43 33.63,18.43 33.94,18.74 34.45,18.74 v34.45,21.18 34.6,21.02 48.11,21.02 49.36,19.78 52.94,19.78 54.89,21.73 v54.89,22.95
  Bottom 0.178: v34.45,21.18 34.45,22.09 34.04,22.5 34.04,23.61 34.65,24.22 34.65,24.63 R11.1
FPGA_INITB  (via drill 0.3)
  Top 0.178: v16.57,18.23 16.57,18.64 16.26,18.94 16.26,21.99 15.25,23 15.25,24.02 U1.38 | U2.P39 36.68,24.02 36.68,22.29 36.38,21.99 36.38,21.48 35.67,20.77 R69.2 35.56,20.77 35.06,20.77 v33.33,19.04
  Route15 0.178: v33.33,19.04 19.11,19.04 18.29,18.23 v16.57,18.23
FPGA_PROGRAM  (via drill 0.3)
  Top 0.178: v35.7,25.92 35.7,24.05 U2.P37 35.67,24.02 v32.82,21.18 | U1.37 14.74,24.02 14.74,23 15.85,21.89 15.85,18.03 v16.87,17.01 | v24.39,19.65 22.56,17.82 v22.36,17.82
  Route15 0.178: v22.36,17.82 21.95,18.23 19.31,18.23 18.5,17.42 18.29,17.42 17.89,17.01 v16.87,17.01 | v32.82,21.18 31.09,19.45 24.59,19.45 v24.39,19.65
  Bottom 0.178: v35.7,25.92 35.07,26.56 R12.1
FSC_AX1
  Top 0.178: J6.7 62.56,38.95 61.78,39.74 60.64,39.74 60.3,39.41 57.1,39.41 56.57,38.88 U2.P98
FSC_AX2
  Top 0.178: J6.8 63.73,37.56 61.09,37.56 59.92,38.73 58.75,38.73 58.68,38.8 57.51,38.8 57.08,38.37 U2.P97
FSC_CLK
  Top 0.178: U2.P100 55.58,39.9 56.62,39.9 56.8,40.07 59.85,40.07 60.18,40.4 60.41,40.4 60.48,40.43 60.58,40.43 61.62,41.47 J6.5
FSC_IO
  Top 0.178: J6.6 64.78,41.47 63.38,40.07 60.48,40.07 60.15,39.74 56.95,39.74 56.6,39.39 U2.P99
  Bottom 0.178: R61.2 65.36,36.09 66.65,37.38 66.65,39.93 J6.6
FSC_RST
  Top 0.178: J6.3 62.03,44.01 58.91,40.89 U2.P102
FSC_VPP  (via drill 0.3)
  Top 0.178: U2.P101 56.27,40.38 56.29,40.4 59.69,40.4 v60.64,41.34
  Bottom 0.178: v60.64,41.34 60.64,41.6 61.8,42.77 66.25,42.77 66.73,42.28 67.27,42.28 R60.2
GLITCHOUT  (via drill 0.3)
  Top 0.178: U2.P66 50.22,22.47 v50.7,21.99
  Top 0.305: JP8.1 64.19,18.3 64.17,18.33 64.17,18.71 R37.2
  Bottom 0.178: v50.7,21.99 51.62,21.07 52.99,21.07 53.12,21.2 53.78,21.2 53.85,21.23 54.21,21.58 55.05,21.58 55.12,21.56 59.34,21.56 59.42,21.53 60.1,20.74 62.54,20.74 62.77,20.46 63.58,19.65 63.28,19.93 63.35,19.91 64.95,18.3 JP8.1
GLITCHOUTLP  (via drill 0.3)
  Top 0.178: U2.P67 50.72,23.02 52.05,21.68 v52.73,21.68
  Bottom 0.178: v52.73,21.68 53.47,21.68 53.78,21.99 59.44,21.99 59.82,22.37 63.25,22.37 63.63,21.99 67.54,21.99 68.25,21.28 68.25,19.17 68.71,18.71 R78.2
GND  (via drill 0.3, 0.51)
  Top 0.178: 22.97,38.18 24.12,38.18 24.12,39.55 25.71,41.14 26.06,41.14 v26.28,41.35 28.8,41.35 29.82,40.33 | R34.1 1.92,33.86 v1.88,33.82 | 31.37,49.67 31.35,49.7 | 28.94,40.47 28.94,40.51 C51.1 | 22.9,36.11 U1.72 | 29.74,40.34 v29.77,40.31 | U2.P73 56.27,26.38 56.52,26.13 58.63,26.13 59.14,26.64 59.14,26.76 59.47,27.09 59.47,27.78 59.44,27.85 59.29,28.01 59.29,28.19 v59.21,28.31 | R77.1 45.91,51.26 v45.88,51.22 | v33.99,57.55 34.88,56.66 34.88,55.77 R42.2 | 33.74,52.21 33.86,52.34 33.86,52.72 R40.2 | 33.74,52.21 33.61,52.09 32.47,52.09 R41.2 | R39.2 35.13,50.94 35.13,51.58 34.88,51.83 34.12,51.83 33.74,52.21 | 28.78,36.36 28.81,36.36 28.81,36.37 | 27.98,36.36 v27.95,36.34
  Top 0.191: 14.75,40.69 v14.72,40.72 | U1.82 18.25,37.82 v18.27,37.8 | U1.72 21.47,36.14 v21.45,36.12 | U1.35 13.76,25.42 v13.73,25.45
  Top 0.203: 28.81,36.37 29.51,37.07 30.31,37.07 30.72,37.48 30.72,39.99 30.34,40.37 29.74,40.37 29.7,40.34 | 29.12,40.34 29.08,40.37 C51.1 | 29.86,40.21 v29.77,40.31 | C84.1 44.45,19.54 U4.23 | 28.78,36.36 27.98,36.36 arc45 27.92,36.34
  Top 0.254: U4.23 44.44,18.02 44.44,17.29 44.75,16.97 v44.75,16.59 | U2.P3 34.41,42.88 v34.95,43.43 | C52.2 29.44,42.44 v29.37,42.51 | v45.12,26.05 44.2,25.14 44.2,24.05 U2.P54 44.2,24.02 44.2,23 44.71,22.5 v45.01,22.5 | U2.P49 41.76,24.08 41.76,25.44 | U2.P13 35.27,37.88 v35.11,37.79 | U2.P68 51.22,25.44 v51.11,25.54 | U2.P77 56.89,28.38 v57.23,28.54 | v31.32,50.56 31.58,50.82 31.58,51.07 32.47,51.96 R41.2
  Top 0.305: U1.89 14.75,40.69 | U1.42 17.26,25.44 v17.33,25.42 | U1.44 18.25,25.37 v18.08,25.42 | U1.46 19.24,25.37 v19.42,25.44 | U1.48 20.26,25.4 v20.21,25.45 | U5.6 U5.5 | U2.P130 42.72,47.68 v42.52,47.87 | U2.P136 39.72,47.71 v39.55,47.87 | U1.3 8.59,36.64 8.69,36.74 8.79,36.74 v9.14,37.09 | U1.61 21.83,30.65 v21.4,31.08 | S1.3 7.13,21.8 v6.76,22.17 | S1.4 1.74,21.8 v1.48,21.53 | R58.1 32.09,16.7 v32.06,16.68 | R57.1 30.18,16.68 v30.16,16.65 | U4.11 47.7,10.52 C97.2 | U4.8 45.74,10.65 C99.2 | U4.14 50.1,12.23 50.2,12.13 50.2,11.78 v50.22,11.75 | R54.1 51.45,16.92 v51.47,16.93 | U2.P25 35.05,31.88 v35.36,31.69 | U2.P108 55.57,44.02 | U2.P113 51.22,45.16 | U2.P96 54.61,37.88 v53.83,37.1 53.8,37.08 53.8,35.76 54.17,35.38 U2.P91 | C24.2 v59.25,37.08 v59.26,37.08 | C31.2 59.35,33.4 v59.36,33.42 | C66.2 v59.33,30.9 v59.34,30.9 | v57.23,28.54 58,28.69 C64.2 v59.2,28.32 v59.21,28.31 | v66.2,29.76 66.17,29.73 C63.2 v65,30.65 | C50.1 27.92,36.35 arc-45 v27.95,36.34 | Q1.2 28.05,36.54 arc-45 27.98,36.36 v27.95,36.34 | C123.2 27.23,35.27 arc45 27.41,35.35 27.84,35.78 27.84,36.13 arc-45 27.92,36.3 v27.95,36.34
  Top 0.406: C57.2 38.2,20.24 v39.1,20.24 | J8.5 26.66,53.77 26.62,53.74 25.99,53.74 v26.12,53.61 v24.47,53.61 | 41.76,25.44 41.36,25.85 v40.34,25.85 | C94.2 34.6,16.4 v34.5,16.3 | C93.2 34.59,14.18 v34.47,14.29 | U4.3 v42.49,13.58 v42.5,13.58 | U4.8 45.74,13.56 v45.73,13.58 | U4.11 47.7,13.57 v47.68,13.58 | R56.1 36.29,10.98 v36.2,10.89 | C76.1 56.74,9.75 | 56.74,9.75 C77.1 55.67,9.98 | 56.74,9.75 v56.74,10.35 v56.75,10.36 | 55.67,9.98 55.43,10.21 C78.1 54.41,11.12 v54.44,11.14 | 55.67,9.98 55.67,10.63 v55.61,10.68 | U3.20 60.43,4.34 v60.66,4.11 60.66,3.95 v61.93,2.68 | U3.17 60.56,6.24 v60.71,6.09 62.31,7.69 63.58,7.69 | U3.9 63.99,9.42 | 63.99,9.42 63.2,9.42 63,9.62 63,10.43 v62.89,10.3 | U3.6 63.76,7.51 63.58,7.69 | 63.58,7.69 63.58,9.26 63.4,9.44 | 63.99,9.42 63.99,10.43 v63.89,10.79 | R4.1 59.92,18.18 v60.76,17.54 | R8.1 59.92,22.73 v60.69,21.56 | R65.2 66.16,23.92 JP8.3 | C56.2 47.25,50.39 v47.25,51.17 | C58.2 v45.88,51.22 | C32.2 v44.48,51.22 | C25.2 v43.21,51.25 | C59.2 41.2,50.29 v41.2,50.31 | 55.57,44.02 v56.7,45.15 56.7,45.71 57.33,46.35 57.33,46.98 57.74,47.39 57.66,47.39 57.64,47.36 | C26.2 57.7,48.14 v57.56,48.28 | C65.2 59.43,43.09 v59.47,43.12 | 51.22,45.16 v50.35,44.29 | J7.2 arc90 3.28,32.68 v3.28,33.85 | Q1.4 26.44,39 27.59,37.85 27.85,37.85 Q1.2 | 27.94,36.35 v27.95,36.34 | 29.08,40.37 29.7,40.37 v29.77,40.31
  Top 0.61: U10.2 36.1,5.86 | C69.1 69.77,2.34 v70.31,1.79
  Top 0.635: C22.2 v28.94,25.92 | C53.2 29.5,29.45 v28.72,29.45 | C16.2 26.34,29.69 v26.34,28.91 26.34,28.05 | 26.34,28.05 26.34,27.88 C9.2 26.59,27.63 C7.2 v27.51,26.24 | 26.34,28.05 26.59,27.8 v27.29,27.8 | v27.23,24.66 C19.2 26.38,26.24 26.56,26.24
  Top 0.762: v17.84,43.43 17.81,43.4 C12.2 C8.2 15.55,43.38 | v13.14,43.43 13.16,43.4 C13.2 C8.2 | C1.2 12.76,45.31 12.98,45.53 12.98,46.65 v13.01,46.58 | U6.1 26.48,46.46 v27.18,47.16 | C48.2 31.35,49.7 31.35,50.54 v31.32,50.56 | U8.3 U8.2 U8.1 74.55,23.78 JP11.3
  Top 0.813: C43.2 19.65,58.26 C42.2 17.8,59.14 v17.73,59.2 | C43.2 C47.2 21.61,59.26 v21.65,59.25 | C43.2 19.7,59.26 v19.74,59.25 | C11.2 3.27,35.13 v3.26,35.15 | C15.2 v3.31,36.72 | C29.2 v28.71,31.42 v28.71,31.41 | C28.2 29.4,35.1 29.01,34.71 v28.68,34.71 | C14.2 18.78,19.61 v18.75,19.57 | v14.38,19.4 14.4,19.42 C17.2 C10.2 13.13,19.48 v13.16,19.45 | v36.91,9.47 36.9,9.46 C110.1 37.82,8.49 v37.95,8.5 38.77,8.5 38.87,8.4 | v38.97,8.4 39.02,8.35 C96.1 41.61,8.35 41.74,8.22 | C95.1 42.77,8.15 v42.78,8.14 42.78,6.82 42.91,6.7 | C87.1 43.07,6.68 v43.03,6.72 | C111.1 39.86,3.45 v39.83,3.42 | 41.26,4.21 C113.1 40.13,4.86 39.81,4.54 | 41.26,4.21 41.26,3.48 v41.23,3.45 | R48.2 43.21,4.52 v42.91,4.21 | v42.91,4.21 41.26,4.21 | R50.1 43.86,3.38 v43.64,3.17 43.64,3.47 v42.91,4.21 | 36.1,5.86 v36.12,5.83 | C112.1 34.66,3.38 v34.62,3.34 | C114.1 30.67,10.19 v30.61,10.25 | C98.2 C97.2 | C100.2 45.53,10.37 C99.2 | C88.2 50.37,6.65 v50.4,6.8 | C79.1 64.76,1.78 v64.72,1.74 | v61.14,1.85 61.18,1.81 C80.1 v61.94,2.67 v61.93,2.68 | C75.1 C74.1 59.71,14.76 v59.67,14.8 | C75.1 62.36,13.88 R45.1 62.56,15.18 v62.54,15.21 | v58.07,13.73 58.12,13.68 C72.1 C73.1 56.53,13.7 v56.52,13.71 | C75.1 v61.3,14.72 | v64.34,15.26 C89.1 62.46,14.04 62.41,13.99
  Top 1.016: 13.7,47.81 C35.2 13.06,46.83 v13.01,46.58 | 13.7,47.81 14.33,47.81 C34.2 14.36,46.85 v14.3,46.6 | 13.7,47.81 13.7,48.84 v13.9,49.27 v13.92,50.31 v13.92,51.35 v13.92,52.47 | C36.2 9.01,56.06 8.13,56.94 8.13,58.16 JP3.2 | C39.2 4.48,40.53 | 4.48,40.53 C38.2 | U7.2 4.46,40.54 4.48,40.53 | v77.55,25.8 77.55,24.91 78.82,23.64 | v79.71,13.1 79.71,11.21 X2.G@2 | v77.93,13.1 77.93,11.95 78.69,11.19 | v79.71,14.62 79.71,16.5 X4.G@1 | v77.93,14.62 77.93,16.4 78.31,16.78 | v79.33,1.92 79.33,3.85 X2.G@1 | v77.81,1.92 77.81,3.57 78.19,3.95 | C27.2 32.05,46.79 31.32,47.52 31.32,48.76 C48.2 | v79.71,25.8 79.71,23.91 X4.G@2 v79.71,25.8
  Top 1.27: v4.68,45.15 4.68,43.36 U7.2
  Bottom 0.152: X4.G@2 79.5,24.12 | X4.G@2 79.5,23.26 | X4.G@2 79.5,25.04 | 79.5,17.92 X4.G@1 79.5,16.65 | X2.G@2 79.5,11.7 | X2.G@2 79.5,10.81 | X2.G@2 79.5,9.92 | X2.G@1 79.5,4.61 | X2.G@1 79.5,3.7 | 79.5,2.84 79.5,2.93 X2.G@1 | X4.G@2 79.5,23.64 | 79.84,16.78 79.84,18.05 | 79.5,16.65 79.71,16.65 79.71,17.92 79.89,17.92 | 79.71,15.86 79.71,15.26 | 79.5,12.59 79.5,11.97 X2.G@2 | X2.G@1 79.5,5.4 | 79.81,4.02 79.81,2.68 | 80.47,4.21 80.47,5.49 | 79.5,16.65 79.46,16.65 | 80.75,11.07 80.22,11.07 | 79.81,4.08 79.81,4.02 | 79.81,4.02 X2.G@1
  Bottom 0.178: R23.2 20.39,49.14 arc45 20.31,49.32 T2.2
  Bottom 0.254: v44.75,16.59 44.74,16.61 C83.1 | C55.2 v35.18,39.72
  Bottom 0.305: C21.2 9,36.96 v9.14,37.09 | U9.4 42.23,34.93 v42.17,34.99 | C49.1 48.91,35.97 v49.18,35.7 | v19.59,50.82 19.59,50.04 T2.2 | C101.2 53.78,37.15 v53.83,37.1
  Bottom 0.381: 9.73,27.58 v10.04,26.64
  Bottom 0.406: D1.2 v59.14,16.12 | C90.1 54.63,16.18 v54.67,16.15 | v50.35,44.29 51.05,44.29 C60.2 | C102.2 53.27,30.7 v53.04,30.93 52.99,30.88 52.91,30.88 52.91,30.06 52.86,30.06 52.17,29.25 R71.2 | C18.2 9.34,27.99 9.73,27.58 | R43.2 74.61,23.73 JP11.3 74.31,21.48 T4.2
  Bottom 0.61: C40.2 34.16,55.47 C41.2 33.04,56.09 v32.59,55.64
  Bottom 0.762: C2.2 20.81,32.56 20.76,32.5 | 21.48,36.09 v21.45,36.12 | R24.1 13.45,52 | R26.1 12.96,52 13.45,52 | 13.45,52 v13.92,52.47
  Bottom 0.813: C5.2 11.49,32.3 v11.46,32.33 | C3.1 18.04,36.63 C4.2 18.05,37.58 v18.27,37.8 | R29.1 19.75,32.8 v20.4,32.15 20.76,32.5 21.05,32.8 C33.2 | C62.2 v45.12,26.05 | v45.01,22.5 45.22,22.29 C30.2 | v40.34,25.85 40.37,25.82 C23.2 | C82.1 61.45,6.82 v60.71,6.09 61.22,5.58 C81.1
  Bottom 1.016: C61.2 40.14,35.91 v40.24,35.81 | C54.2 40.12,34.6 v40.24,34.48 | C20.2 39.79,33.3 v39.93,33.16 | C6.2 14.96,20.66 C17.2 14.6,19.62 14.43,19.45 | 14.43,19.45 v14.38,19.4 | 14.43,19.45 v13.16,19.45 | v79.33,1.92 79.33,3.83 79.46,3.95 | v77.81,1.92 77.81,3.57 78.06,3.83 | v77.93,13.1 77.93,11.19 | v79.71,13.1 79.71,11.19 79.58,11.07 | v79.71,14.62 79.71,15.86 79.71,16.65 79.84,16.78 | v77.93,14.62 77.93,16.4 78.31,16.78 | 79.96,23.64 79.71,23.89 v79.71,25.8 X4.G@2 | v77.55,25.8 77.55,24.27 78.19,23.64 | 34.16,55.47 32.77,55.47 32.72,55.52 32.72,55.26 33.35,54.63 33.99,54.63
  Bottom 1.27: C46.2 6.55,50.37 v6.91,50.74 | C45.2 C44.2 v4.68,45.15
  other vias: 13.01,58.97 14.64,58.97 16.26,58.97 14.64,55.72 13.31,55.72 7.85,56.02 9.38,56.74 9.38,59.28 23.73,38.53 30.69,11.83 33.48,8.27 33.48,3.45 38.56,3.19 42.37,2.94 46.18,1.16 49.48,1.16 53.29,1.16 57.61,1.16 58.37,2.94 52,6.75 53.65,6.75 55.28,6.85 60.15,11.57 54.82,12.34 70.57,10.3 70.57,9.03 72.09,10.81 66.25,11.07 66.76,3.95 67.77,1.41 51.95,12.92 51.34,11.73 51.16,10 45.93,16.15 49.23,16.15 40.59,13.61 71.84,1.41 73.36,1.41 73.36,2.43 74.88,2.43 74.88,1.41 76.15,1.41 76.15,2.43 61.93,10.81 59.9,2.94 1.22,59.07 5.8,59.07 5.54,46.37 33.99,58.82 65.23,59.07 73.61,58.31 79.96,58.31 61.93,50.69 65.99,50.69 48.98,44.34 39.83,18.94 41.86,16.4 5.03,1.41 13.67,2.18 21.29,2.18 29.67,1.41 29.67,4.97 29.67,8.53 29.67,14.11 26.62,14.11 3.51,38.75 1.48,16.65 1.73,5.73 1.73,10.3 0.97,46.63 7.32,16.65 22.56,19.7 21.04,12.34 22.31,21.48 30.94,21.23 28.91,17.54 27.77,20.34 30.69,44.59 51.52,36.97 51.52,33.67 38.56,29.35 39.83,30.62 40.34,37.99 75.39,13.86 72.85,13.86 76.41,28.34 72.6,28.34 72.85,15.89
  pour GNDPour: -5.38,64.66 80.75,65.02 80.75,-6.1 -7.92,-6.46 -7.92,64.66
  pour Top (no thermals): 6.81,59.99 22.66,59.99 22.66,55.72 15.45,55.72 15.45,54.6 6.81,54.6
  pour Top (isolate 0.203): 33.53,1.97 40.34,1.97 40.34,0.35 77.53,0.35 77.53,11.83 69.4,11.83 65.33,16.65 41.05,16.65 39.63,17.31 34.75,17.31 33.84,16.4 33.84,14.37 33.02,13.56 30.28,13.56 29.57,12.84 29.57,9.49 30.38,8.68 32.21,8.68 32.62,8.27 32.62,2.89
  pour Bottom (isolate 0.33): -0.94,61.38 81.16,61.38 81.16,-4.5 -1.04,-4.5 -1.04,61.31
  pour Route15 (isolate 0.305): -0.81,60.34 81.49,60.34 81.49,-2.9 -0.81,-2.9
LED_ARMED
  Top 0.178: D6.A 36.4,54.5 38.69,52.21 38.69,51.71 37.8,50.82 37.8,49.04 37.42,48.66 37.42,48.28 37.16,48.02 37.16,46.24 U2.P141
LED_CAPTURE
  Top 0.178: D5.A 37.55,51.96 37.42,51.83 37.42,49.17 37.04,48.78 37.04,48.4 36.66,48.02 36.66,46.24 U2.P142
LED_STATUS  (via drill 0.3)
  Top 0.178: U2.P144 35.77,46.27 35.77,48.15 36.28,48.66 36.28,49.37 v36.33,49.45
  Bottom 0.178: R68.1 34.96,49.68 v36.33,49.45
LED_TCLOCK
  Top 0.178: U2.P140 37.67,46.24 37.67,48.02 37.8,48.15 37.8,48.53 38.18,48.91 38.18,50.69 39.07,51.58 39.07,52.34 37.67,53.74 37.67,57.04 D7.A
LED_USBACT
  Top 0.178: D4.A 35.39,49.42 36.02,50.05 36.66,50.05 37.04,49.67 37.04,49.29 36.66,48.91 36.66,48.53 36.28,48.15 36.28,46.24 U2.P143
N$1
  Top 0.178: U1.96 11.27,40.14 11.56,40.43 11.56,41.67 R14.1
N$2
  Top 0.178: U1.40 16.26,23 17.07,22.19 17.07,19.14 18.19,18.03 18.29,18.03 19.61,16.7 19.61,14.67 JP1.3
N$3  (via drill 0.3)
  Top 0.178: U1.58 21.49,29.15 21.34,29 20.17,29 19.99,28.82 19.99,28.31 v19.89,28.21
  Bottom 0.178: 23.13,29.18 R1.1 20.63,29 20.25,28.62 20.25,28.57 v19.89,28.21
N$4
  Top 0.178: U1.41 16.77,23 17.48,22.29 17.48,19.25 18.29,18.43 18.39,18.43 JP1.2
N$5  (via drill 0.3)
  Top 0.178: U2.P70 v52.22,25.89
  Bottom 0.178: v52.22,25.89 52.22,26.47 51.92,26.76 51.34,26.76 51.31,26.73 | 51.31,26.73 R5.1 | 51.97,27.97 R71.1 51.29,27.95 | U9.6 44.81,41.63 44.81,39.87 46.74,37.94 46.74,33.47 47.35,32.86 47.33,27.78 47.35,27.7 47.35,27.52 47.68,27.2 48.95,27.2 49.66,27.91 49.68,27.97 R70.2 50.67,27.95 51.29,27.95 | 51.31,26.73 51.31,27.93 51.29,27.95
N$6  (via drill 0.3)
  Top 0.178: U1.19 9.28,28.64 9.4,28.52 11.03,28.52 12.38,29.86 v15.14,29.86
  Bottom 0.178: R2.1 14.46,30.55 v15.14,29.86
N$7  (via drill 0.3)
  Top 0.178: U2.P38 36.22,25.23 v36.96,25.98
  Route15 0.178: v44.1,33.37 47.58,36.85 47.58,37.43 v47.53,37.43 | v42.88,32.2 36.96,26.28 v36.96,25.98
  Bottom 0.178: v44.1,33.37 44.05,33.37 v42.88,32.2 | v47.53,37.43 47.53,35.13 U9.1
  Bottom 0.305: U9.1 47.72,34.93 48.47,34.18 48.47,32.62 R9.1
N$8
  Top 0.178: U2.P60 47.25,24.02 47.25,22.19 48.77,20.67 48.77,19.85 49.28,19.35 49.99,19.35 50.7,18.64 58.22,18.64 | 58.22,18.64 58.22,20.16 R3.2 | 58.22,18.64 R4.2
N$9
  Top 0.178: R7.2 R8.2 57.79,22.32 52.25,22.32 51.72,22.85 U2.P69
N$10  (via drill 0.3)
  Top 0.178: v49.69,25.44 49.18,24.93 49.18,24.12 U2.P64
  Route15 0.178: v43.49,39.97 43.49,31.95 49.69,25.75 v49.69,25.44
  Bottom 0.178: v43.49,39.97 43.49,41.6 U9.5
N$11  (via drill 0.3)
  Top 0.178: U2.P65 49.72,22.83 v49.48,22.6
  Route15 0.178: v45.01,31.34 45.01,30.93 49.89,26.05 49.99,26.05 50.3,25.75 50.3,23.41 v49.48,22.6
  Bottom 0.178: R6.2 34.55,23 34.75,22.8 37.39,22.8 39.63,20.57 47.71,20.57 49.13,21.99 49.13,22.24 v49.48,22.6 | v45.01,31.34 45.52,30.83 46.03,30.83 R22.2
N$12
  Bottom 0.305: R22.1 U9.2
N$13  (via drill 0.3)
  Top 0.178: U1.20 13.06,28.13 13.09,28.06 13.29,27.85 v13.31,27.85
  Bottom 0.178: v13.31,27.85 14.23,28.77 14.23,28.92 R10.1
N$15
  Top 0.305: U5.4 17.27,55.32 17.43,55.16
  Top 0.61: 17.43,55.16 17.43,54.8
  Top 1.016: 17.43,54.8 17.43,52.06 L2.1
N$16
  Bottom 0.178: R21.1 4.84,8.46 6.05,7.26 6.05,4.97 J3.3
N$17
  Bottom 0.406: R15.1 16.32,35.26 15.55,36.03 15.55,36.59 C3.2
N$18  (via drill 0.3)
  Top 0.191: U1.79 19.75,38.1 v19.45,37.8
  Bottom 0.305: R15.2 18.33,35.31 19.05,36.03 19.05,36.32 C4.1
  Bottom 0.813: C4.1 19.35,37.7 v19.45,37.8 | L1.2 18.39,35.2 R15.2
N$19
  Top 0.178: U2.P120 47.71,46.24 47.71,47.21 48.37,47.87 48.37,54.09 47.02,55.44 45.12,55.44 44.07,56.48 41.86,56.48 J5.1
N$20
  GNDPour 0: 33.48,-0.36 33.48,1.67 39.58,1.67 39.58,-0.36
N$21
  Bottom 0.178: R16.1 23.26,8.46 23.83,7.89 23.83,4.97 J3.15
N$23
  Top 0.203: U1.80 19.24,41.41 R27.1
N$24
  Top 0.305: U5.8 10.94,54.82 10.72,54.6
  Top 0.61: 10.72,54.6 10.72,54.14
  Top 1.016: 10.72,54.14 10.72,51.88 L3.1
N$25  (via drill 0.51)
  Top 0.178: 15.77,39.98 15.77,40.02
  Top 0.254: U1.83 17.73,39.27 17.73,40.4 | 15.77,37.13 U1.87 15.77,39.98 15.77,40.09 16.03,40.61 | U1.9 7.66,33.67 | U1.34 13.23,24.05 13.23,24.88 12.97,25.13 12.97,26.05 | 24.05,29.58 23.99,29.63 | U1.59 | 22.86,26.15 U1.52 22.89,26.12 | 24.24,26.24 C7.1
  Top 0.305: U1.34 13.25,22.16 C10.1 | C9.1 24.05,28.86 24.05,29.58 | 23.99,29.63 U1.59 | U1.59 21.2,29.64 21.09,29.53 18.95,29.53 18.34,28.93 | 22.89,26.12 24.12,26.12 24.24,26.24 | U1.9 6.15,33.65 5.52,34.28 5.52,35.05 C11.1 | 7.66,33.67 9.66,33.67 9.86,33.47 10.5,33.47 10.93,33.9 15.51,33.9 15.77,33.65 | 15.56,34.05 15.77,33.85 | 22.86,26.15 19.77,26.15 19.44,26.48 19.44,27.43 19.35,27.43 18.98,27.8 18.57,27.8 18.34,28.03 | 20.17,36.16 20.98,36.97 21.59,36.97 21.92,36.64 U1.73 23.83,36.64 arc-45 24.01,36.57 25.2,35.37 25.64,35.12 arc-45 25.69,35.3 C123.1 | C19.1 25.09,26.04 C7.1 | 17.73,40.4 17.73,41.65 17.5,41.88 17.07,41.88 C12.1
  Top 0.406: C12.1 C8.1 15.63,42.05 15.63,41.49 16.03,41.09 16.03,40.61 | 20.17,36.16 15.77,36.16 | 13.31,26.51 13.31,26.4 12.97,26.05
  Top 0.813: 15.77,32.39 15.36,32.39 v15.32,32.05
  Top 1.016: 15.77,37.13 15.77,36.16 15.77,35.87 16.03,35.6 16.03,34.52 15.56,34.05 | 15.77,33.85 15.77,33.65 15.77,33.01 | 15.77,33.01 15.77,32.39 15.77,32.02 | 15.77,33.01 17.56,33.01 18.34,32.22 18.34,28.93 18.34,28.03 17.25,26.94 14.3,26.97 13.31,26.51
  Bottom 0.813: v15.32,32.05 C5.1
N$26
  Top 0.203: U1.81 18.76,40.17 18.24,40.69 18.24,42.66 18.66,43.07 R28.1
N$27  (via drill 0.51)
  Top 0.406: SJ1.3 24.02,51.01 23.7,51.07 v23.7,52.59
  Route15 1.016: 22.94,53.1 23.2,53.1 v23.7,52.59
  Route15 1.778: JP3.1 11.17,58.17 11.89,57.45 21.65,57.45 22.05,57.04 22.05,53.99 22.94,53.1
N$28  (via drill 0.3)
  Top 0.191: U1.78 20.26,37.81 v20.59,37.58
  Bottom 0.305: v20.59,37.58 20.59,37.32 20.4,37.13 20.4,34.95 20.43,34.93
  Bottom 0.813: R29.2 20.43,34.93 C33.1
N$29  (via drill 0.51)
  Top 0.406: SJ1.2 25.3,52.52 v25.23,52.59
  Top 0.61: 25.1,52.57 25.3,52.37 SJ1.2 25.3,50.03 25,49.73 23.98,49.73 v23.78,49.52
  Route15 1.27: v23.78,49.52 16.06,49.52 15.45,48.91 15.45,48.4 14.94,47.9 12.2,47.9 11.69,48.4 11.69,48.91 11.49,49.12 v7.73,49.12
  Bottom 0.305: T1.2 22.26,55.73 arc45 22.18,55.91 R31.2
  Bottom 1.016: v25.23,52.59 25.23,51.78 25.2,51.76 25,51.76 24.49,51.25 23.17,51.25 22.56,51.86 22.56,54.39 T1.2
  Bottom 1.27: v7.73,49.12 7.52,49.12 6.51,48.1 2.93,48.1 | 2.93,48.1 L6.1 | 2.93,48.1 2.93,50.32 C46.1
N$30  (via drill 0.3)
  Top 0.178: 58.07,45.53 v57.99,45.74 57.61,45.36 57.61,45.1 56.98,44.47 56.98,43.83 56.52,43.38 U2.P107
  Bottom 0.178: v57.99,45.74 59.06,47.11 59.11,47.11 60.18,48.17 60.18,51.5 63.25,54.58 63.25,54.87 J4.6
N$31  (via drill 0.3, 0.51)
  Top 0.406: J8.1 29.29,54.88 29.29,53.74 v29.93,53.1 v30.94,53.1 | SJ1.1 26.56,51.01 26.75,51.2 v26.75,52.59 | U6.4 26.44,44.26 v27.11,44.16
  Route15 0.406: v29.93,53.1 29.39,53.64 27.69,53.64 27.69,53.53 v26.75,52.59
  Bottom 0.254: 26.8,52.54 26.73,52.47 26.73,52.67 26.83,52.77
  Bottom 0.406: v27.11,44.16 27.08,45.25 26.14,46.19 26.14,49.75 26.8,50.41 26.8,52.54 v26.75,52.59
N$32  (via drill 0.51)
  Top 1.016: v20.22,52.67 21.14,52.67 21.54,53.08 21.54,54.46 L4.1 21.61,54.6 C47.1
  Route15 1.016: v20.22,52.67 21.04,52.67 22.36,51.35 27.64,51.35 28.25,51.96 32.21,51.96 32.62,52.37 32.62,53.99 37.93,53.99 v39.7,55.77
  Bottom 1.016: T1.1 20.24,52.66 v20.22,52.67 | v39.7,55.77 39.7,55.79 L5.1
N$33
  Bottom 0.178: R79.2 arc-45 R79.2 19.64,54.63 20.17,54.63 arc45 T1.3
  Bottom 0.305: 20.24,54.6 T1.3 20.31,55.99 20.59,56.39 R31.1 20.39,56.4 arc-45 20.31,56.58 C122.1
N$34
  Bottom 0.178: T2.1 20.82,51.39 arc-45 20.64,51.46 20.4,51.71 18.97,51.71 arc-45 18.79,51.78 R79.1
N$35  (via drill 0.3)
  Top 0.406: J8.E1 J8.P$1 | J8.E2 J8.P$2 | C48.1 29.65,50.44 v29.8,50.59
  Bottom 0.406: J8.P$4 24.46,55.98 J8.P$2 J8.P$1 31.46,55.98 J8.P$3 28.45,54.9 | 28.45,54.9 25.71,54.9 25.61,55.01 | v29.8,50.59 28.81,50.59 28.25,51.15 28.25,54.7 28.45,54.9
N$36
  Top 0.178: U2.P110 52.71,46.24 52.71,47.06 54.18,48.53 54.18,49.04 56.72,51.58 58.75,51.58 61.04,53.87 61.04,55.07 J4.5
N$37  (via drill 0.3)
  Top 0.178: U2.P106 55.58,42.89 56.55,42.89 57.36,43.7 57.36,44.34 57.87,44.85 58.6,44.85 58.73,44.98 58.73,48.76 58.7,48.84 58.45,49.09 v58.37,49.06
  Bottom 0.178: v58.37,49.06 J4.4
N$38  (via drill 0.3)
  Top 0.178: v54.92,48.38 54.54,48.38 53.22,47.06 53.22,46.24 U2.P109